# EAGLE design Version3 (EAGLE 7.2.0)
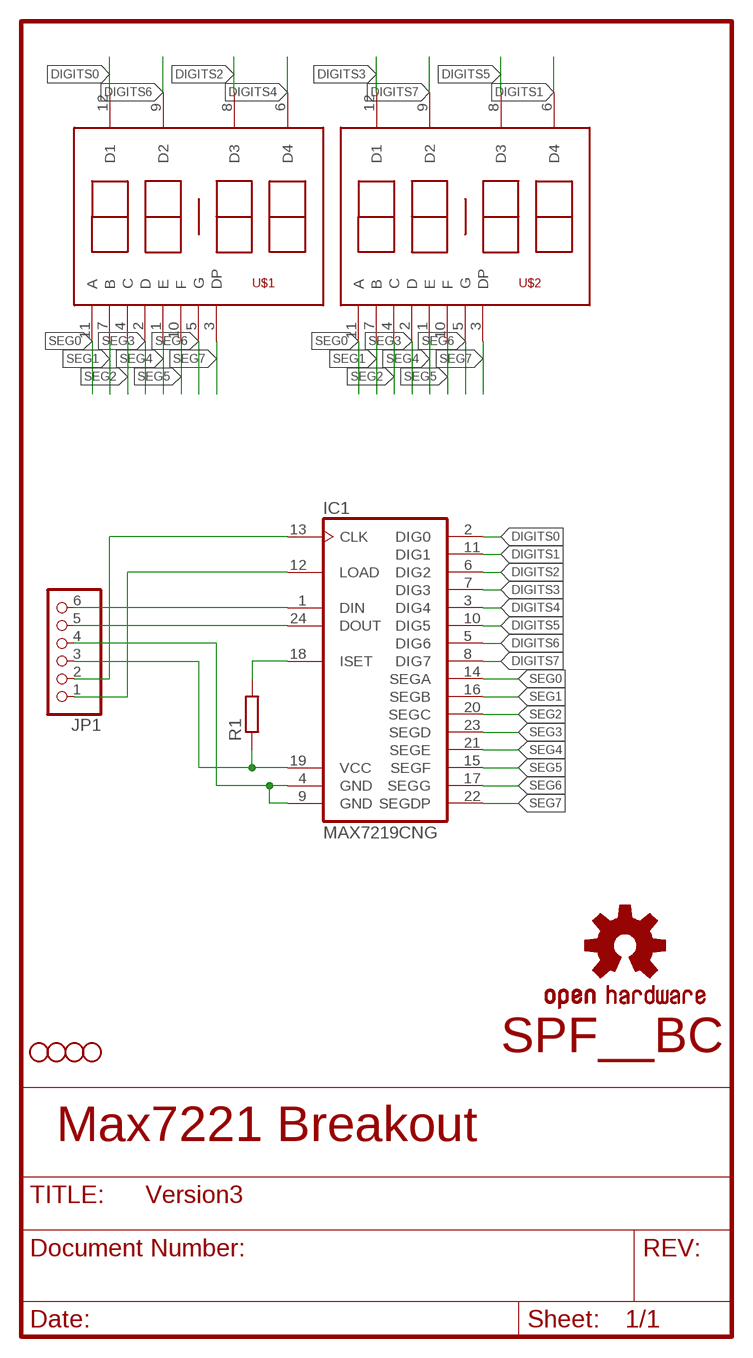
[diagram p0: schematic, sheet 1]

## Parts
H1  STAND-OFF  [STAND-OFF]
H2  STAND-OFF  [STAND-OFF]
H3  STAND-OFF  [STAND-OFF]
H4  STAND-OFF  [STAND-OFF]
IC1  MAX7219CNG  [DIL24-3]
JP1  PINHD-1X6CLEAN  [1X06-CLEAN]
LOGO1  OSHW-LOGOL  [OSHW-LOGO-L]
R1  R-EU_0207/10  [0207/10]
U$1  4DIG_7SEG_CATHODE  [4DIG_7SEG_CLOCK]
U$2  4DIG_7SEG_CATHODE  [4DIG_7SEG_CLOCK]

## Nets
DIGITS0: IC1.2(DIG0) U$1.12(D1)
DIGITS1: IC1.11(DIG1) U$2.6(D4)
DIGITS2: IC1.6(DIG2) U$1.8(D3)
DIGITS3: IC1.7(DIG3) U$2.12(D1)
DIGITS4: IC1.3(DIG4) U$1.6(D4)
DIGITS5: IC1.10(DIG5) U$2.8(D3)
DIGITS6: IC1.5(DIG6) U$1.9(D2)
DIGITS7: IC1.8(DIG7) U$2.9(D2)
DIN: IC1.1(DIN) JP1.6
DOUT: IC1.24(DOUT) JP1.5
GND: IC1.4(GND) IC1.9(GND) JP1.4
ISET: IC1.18(ISET) R1.2
LOAD: IC1.12(LOAD) JP1.1
SCLK: IC1.13(CLK) JP1.2
SEG0: IC1.14(SEGA) U$1.11(A) U$2.11(A)
SEG1: IC1.16(SEGB) U$1.7(B) U$2.7(B)
SEG2: IC1.20(SEGC) U$1.4(C) U$2.4(C)
SEG3: IC1.23(SEGD) U$1.2(D) U$2.2(D)
SEG4: IC1.21(SEGE) U$1.1(E) U$2.1(E)
SEG5: IC1.15(SEGF) U$1.10(F) U$2.10(F)
SEG6: IC1.17(SEGG) U$1.5(G) U$2.5(G)
SEG7: IC1.22(SEGDP) U$1.3(DP) U$2.3(DP)
VCC: IC1.19(VCC) JP1.3 R1.1

## Notes on the sheet
- SPF__BC
- Max7221 Breakout

## Library data of the parts
H1-H4 = SparkFun-Electromechanical:STAND-OFF: #4 Stand Off This is the mechanical footprint for a #4 phillips button head screw. Use the keepout ring to avoid running the screw head into surrounding components. SKU : PRT-00447
IC1 = maxim:MAX7219CNG: LED DISPLAY DRIVER; MF: MAXIM; MPN: MAX7219CNG; OC_FARNELL: 1523914; OC_NEWARK: 34C4018
JP1 = adafruit:PINHD-1X6: PIN HEADER
LOGO1 = SparkFun-Aesthetics:OSHW-LOGO: Open Source Hardware Logo This logo indicates the piece of hardware it is found on incorporates a OSHW license and/or adheres to the definition of open source hardware found here: http://freedomdefined.org/OSHW
R1 = rcl:R-EU_: RESISTOR, European symbol
U$1 U$2 = brv_v6_2:4DIG_7SEG_CATHODE

## Net classes
0 default: width 0.203 mm, drill 0.381 mm, clearance 0.203 mm

## Board
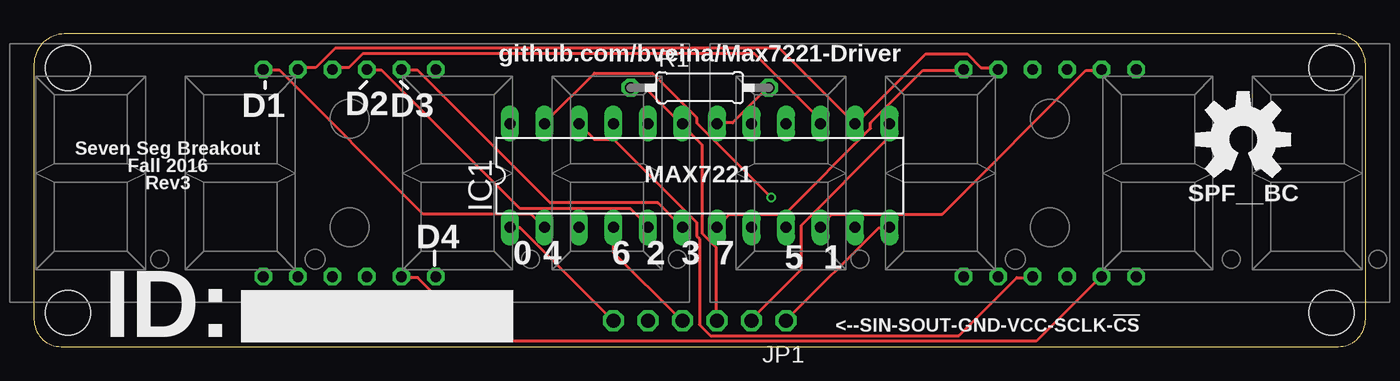
[diagram p1: board, top side]
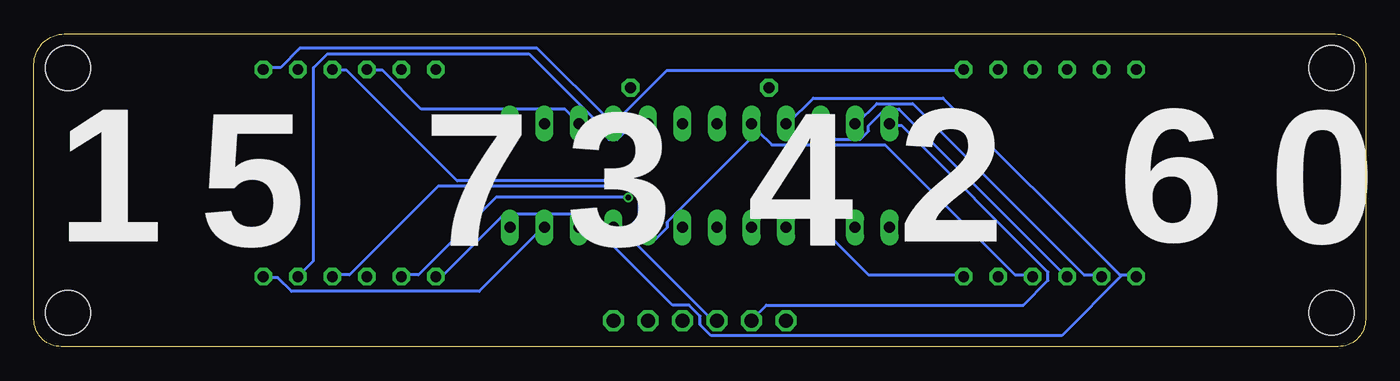
[diagram p2: board, bottom side, seen from below]

Size 98 x 23 mm. Coordinates in mm from the lower left corner, seen from the top.
Outline: 2,0 96,0 arc90 98,2 98,20.76 arc90 95.76,23 2.24,23 arc90 0,20.76 0,2 arc90 2,0
Copper layers (1*16): Top 0.035mm / dielectric 1.5mm / Bottom 0.035mm
Design rules "Dirty8TS *": minimum track width 5mil, minimum drill 12mil, track to track 8mil, track to pad 8mil, pad to pad 8mil, via to via 8mil, smd to smd 0mil, copper to edge 10mil, drill to drill 10mil, minimum pad ring 10mil, minimum via ring 6mil, stop-mask expansion 2mil, vias tented up to drill 25mil, thermal gap 10mil

### Footprints (pad centres in the part's own frame; a part is rotated, then mirrored left to right if it is on the bottom)
STAND-OFF = hole 3.302: 0,0
DIL24-3 = drill 0.813 long: 1 -13.97,-3.81; 2 -11.43,-3.81; 3 -8.89,-3.81; 4 -6.35,-3.81; 5 -3.81,-3.81; 6 -1.27,-3.81; 7 1.27,-3.81; 8 3.81,-3.81; 9 6.35,-3.81; 10 8.89,-3.81; 11 11.43,-3.81; 12 13.97,-3.81; 13 13.97,3.81; 14 11.43,3.81; 15 8.89,3.81; 16 6.35,3.81; 17 3.81,3.81; 18 1.27,3.81; 19 -1.27,3.81; 20 -3.81,3.81; 21 -6.35,3.81; 22 -8.89,3.81; 23 -11.43,3.81; 24 -13.97,3.81
1X06-CLEAN = drill 1.016 octagon: 1 -6.35,0; 2 -3.81,0; 3 -1.27,0; 4 1.27,0; 5 3.81,0; 6 6.35,0
0207/10 = drill 0.813 octagon: 1 -5.08,0; 2 5.08,0
4DIG_7SEG_CLOCK = drill 0.8 octagon: 1 -6.35,-7.62; 2 -3.81,-7.62; 3 -1.27,-7.62; 4 1.27,-7.62; 5 3.81,-7.62; 6 6.35,-7.62; 7 6.35,7.62; 8 3.81,7.62; 9 1.27,7.62; 10 -1.27,7.62; 11 -3.81,7.62; 12 -6.35,7.62

### Placement (x,y rotation side)
H1  2.5,20.5 0 top
H2  2.5,2.5 0 top
H3  95.5,2.5 0 top
H4  95.5,20.5 0 top
IC1  49,12.59 0 top
JP1  49,1.91 180 top
LOGO1  89,15.24 0 top
R1  49,19.05 0 top
U$1  23.23,12.77 0 top
U$2  74.77,12.77 0 top

### Tracks (layer width: path | path; a pad name or v marks a point on that pad's centre or on a via)
DIGITS0
  Top 0.203: U$1.12 17.07,20.32 18.09,20.32 28.65,9.75 36.58,9.75 37.39,8.94 IC1.2
DIGITS1
  Bottom 0.203: U$2.6 81.08,5.08 80.06,5.08 79.05,4.06 65.23,4.06 60.55,8.74 IC1.11
DIGITS2
  Top 0.203: U$1.8 27.23,20.32 28.25,20.32 38,10.57 45.92,10.57 47.55,8.94 IC1.6
DIGITS3
  Top 0.203: U$2.12 68.28,20.32 65.43,20.32 61.57,16.46 61.57,16.05 55.27,9.75 51.21,9.75 50.39,8.94 IC1.7
DIGITS4
  Bottom 0.203: U$1.6 29.67,5.28 36.58,5.28 40.03,8.74 IC1.3
DIGITS5
  Top 0.203: U$2.8 78.44,20.32 77.42,20.32 66.85,9.75 58.73,9.75 57.91,8.94 IC1.10
DIGITS6
  Top 0.203: U$1.9 24.59,20.32 25.6,20.32 35.76,10.16 43.89,10.16 45.11,8.94 IC1.5
DIGITS7
  Bottom 0.203: U$2.9 76,20.32 74.98,20.32 66.85,12.19 53.85,12.19 52.83,11.18 52.83,8.94 IC1.8
DIN
  Top 0.203: IC1.1 35.15,8.74 35.76,8.74 42.47,2.03 JP1.6
DOUT
  Bottom 0.203: IC1.24 34.95,16.26 34.14,16.26 23.37,5.49 23.37,4.88 25.2,3.05 44.09,3.05 45.11,2.03 JP1.5
GND
  Top 0.203: IC1.4 42.67,8.74 42.67,6.91 47.55,2.03 JP1.4
  Bottom 0.203: IC1.9 55.27,8.74 54.86,8.74 48.16,2.03 47.75,2.03 JP1.4
ISET
  Top 0.203: IC1.18 50.39,16.46 51.41,16.46 54.05,19.1 R1.2
LOAD
  Top 0.203: IC1.12 62.79,8.74 62.18,8.74 55.47,2.03 JP1.1
SCLK
  Top 0.203: IC1.13 62.79,16.26 62.79,15.24 56.49,8.94 56.49,5.69 52.83,2.03 JP1.2
SEG0
  Top 0.203: U$1.11 19.51,20.52 20.73,20.52 22.15,21.95 54.86,21.95 60.35,16.46 IC1.14 60.55,16.46 65.63,21.54 68.68,21.54 69.7,20.52 70.92,20.52 U$2.11
SEG1
  Bottom 0.203: U$1.7 29.67,20.32 51.41,20.32 55.27,16.46 IC1.16 55.47,16.46 60.96,21.95 78.44,21.95 79.86,20.52 81.08,20.52 U$2.7
SEG2
  Bottom 0.203: 44.7,15.85 45.11,16.26 IC1.20 | 44.7,15.85 43.69,14.83 35.36,14.83 25.81,5.28 24.59,5.28 U$1.4 | 44.7,15.85 51.41,9.14 51.41,8.74 52.43,7.72 53.24,7.72 53.85,8.33 53.85,9.14 53.44,9.55 53.44,11.18 54.05,11.79 68.28,11.79 74.78,5.28 76,5.28 U$2.4
SEG3  (via drill 0.38)
  Top 0.203: v54.25,10.97 48.77,16.46 48.77,16.87 45.52,20.12 41.25,20.12 37.59,16.46 IC1.23
  Bottom 0.203: U$1.2 19.51,5.28 20.73,5.28 33.33,17.88 35.97,17.88 37.39,16.46 IC1.23 | v54.25,10.97 64.01,10.97 69.7,5.28 70.92,5.28 U$2.2
SEG4
  Bottom 0.203: 17.88,5.28 18.09,5.28 31.09,18.29 40.64,18.29 42.47,16.46 IC1.21 | 17.88,5.28 17.07,5.28 U$1.1 | 17.88,5.28 22.35,0.81 48.16,0.81 48.97,1.63 48.97,2.23 49.78,3.05 51,3.05 56.49,8.53 56.49,8.94 57.3,9.75 63.4,9.75 67.87,5.28 68.28,5.28 U$2.1
SEG5
  Top 0.203: U$1.10 22.15,20.52 23.16,20.52 24.18,21.54 53.03,21.54 57.71,16.87 57.71,16.46 IC1.15
  Bottom 0.203: U$2.10 73.36,20.32 72.34,20.32 69.49,17.48 58.93,17.48 57.91,16.46 IC1.15
SEG6
  Top 0.203: U$1.5 27.23,5.08 28.25,5.08 32.92,0.41 73.76,0.41 78.44,5.08 U$2.5
  Bottom 0.203: IC1.17 52.83,16.26 54.05,16.26 55.07,15.24 55.68,15.24 56.9,16.46 56.9,16.87 61.57,21.54 76.4,21.54 77.42,20.52 77.42,6.3 78.44,5.28 U$2.5
SEG7
  Top 0.203: U$2.3 73.36,5.08 72.34,5.08 68.07,0.81 49.78,0.81 48.97,1.63 48.97,7.92 48.77,8.13 48.77,9.14 42.67,15.24 41.25,15.24 40.23,16.26 IC1.22
  Bottom 0.203: U$1.3 22.15,5.28 34.34,17.48 35.36,17.48 36.58,16.26 36.58,15.85 37.19,15.24 39.01,15.24 40.03,16.26 IC1.22
VCC
  Top 0.203: R1.1 44.09,18.9 45.11,18.9 47.55,16.46 IC1.19 47.75,16.26 49.17,14.83 49.17,8.33 50.19,7.32 50.19,2.03 JP1.3

### Text on the board
tPlace: github.com/bveina/Max7221-Driver | D1 | D2 | D3 | Seven Seg Breakout | Fall 2016 | MAX7221 | Rev3 | SPF__BC | D4 | 0 | 4 | 6 | 2 | 3 | 7 | 5 | 1 | ID: | <--SIN-SOUT-GND-VCC-SCLK-!CS
bPlace: 0 | 6 | 2 | 1 | 4 | 3 | 7 | 5